# EAGLE schematic Main (EAGLE 8.7.0)
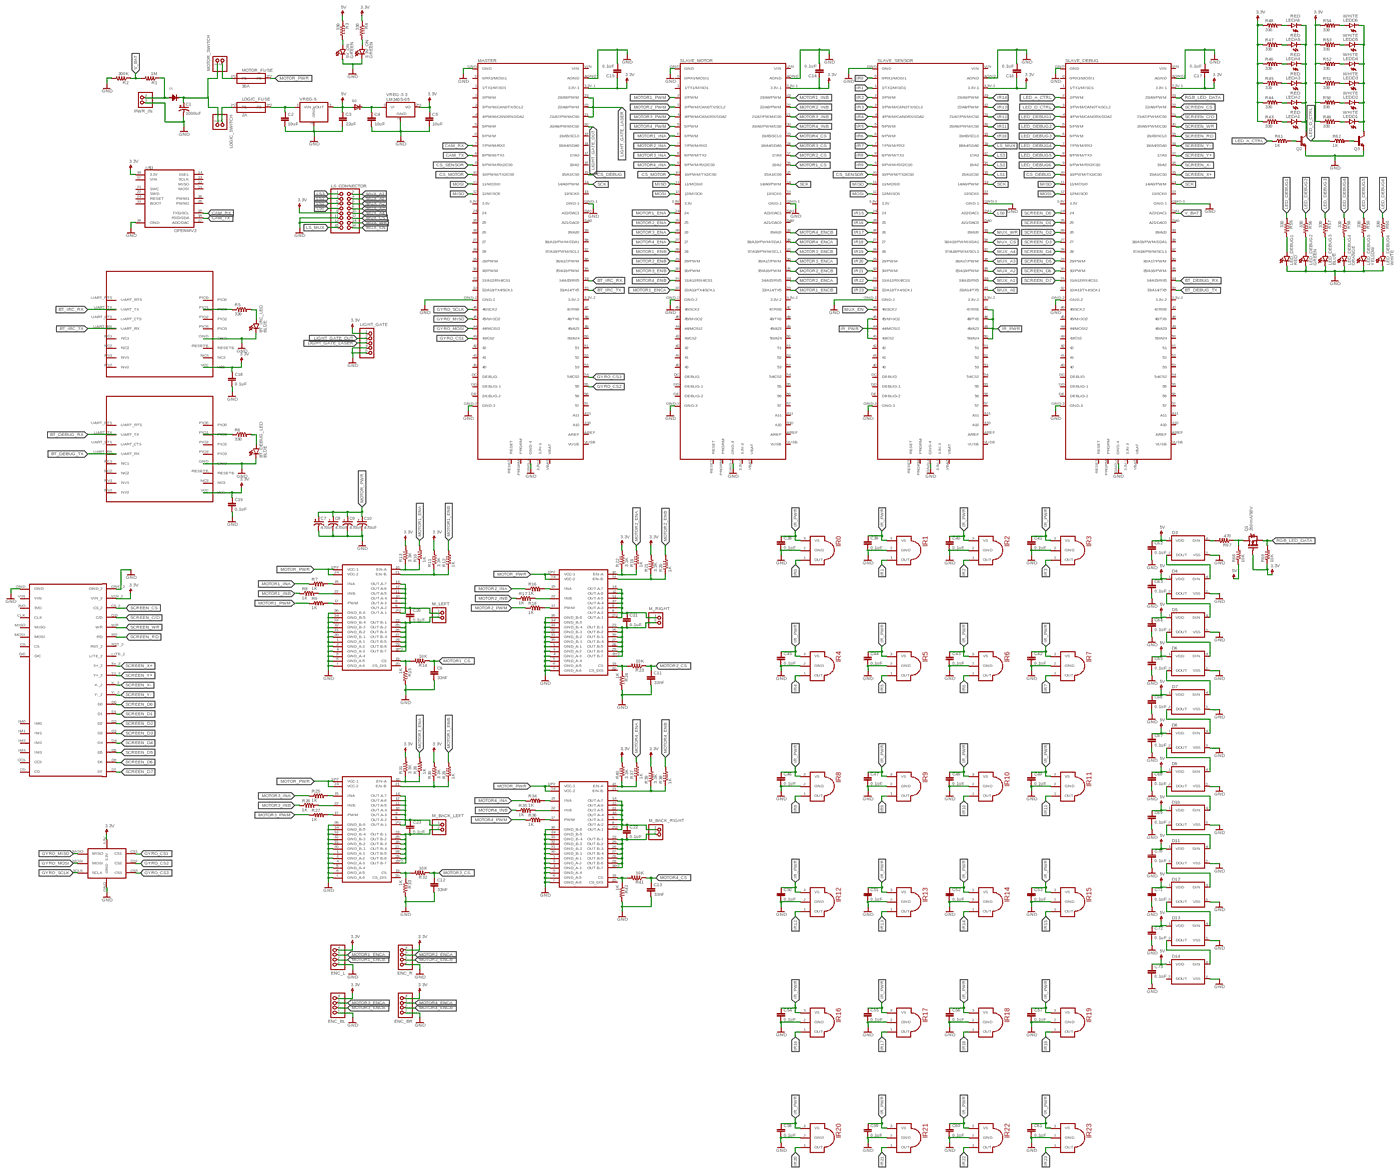
[diagram p0: schematic, sheet 1, overview]
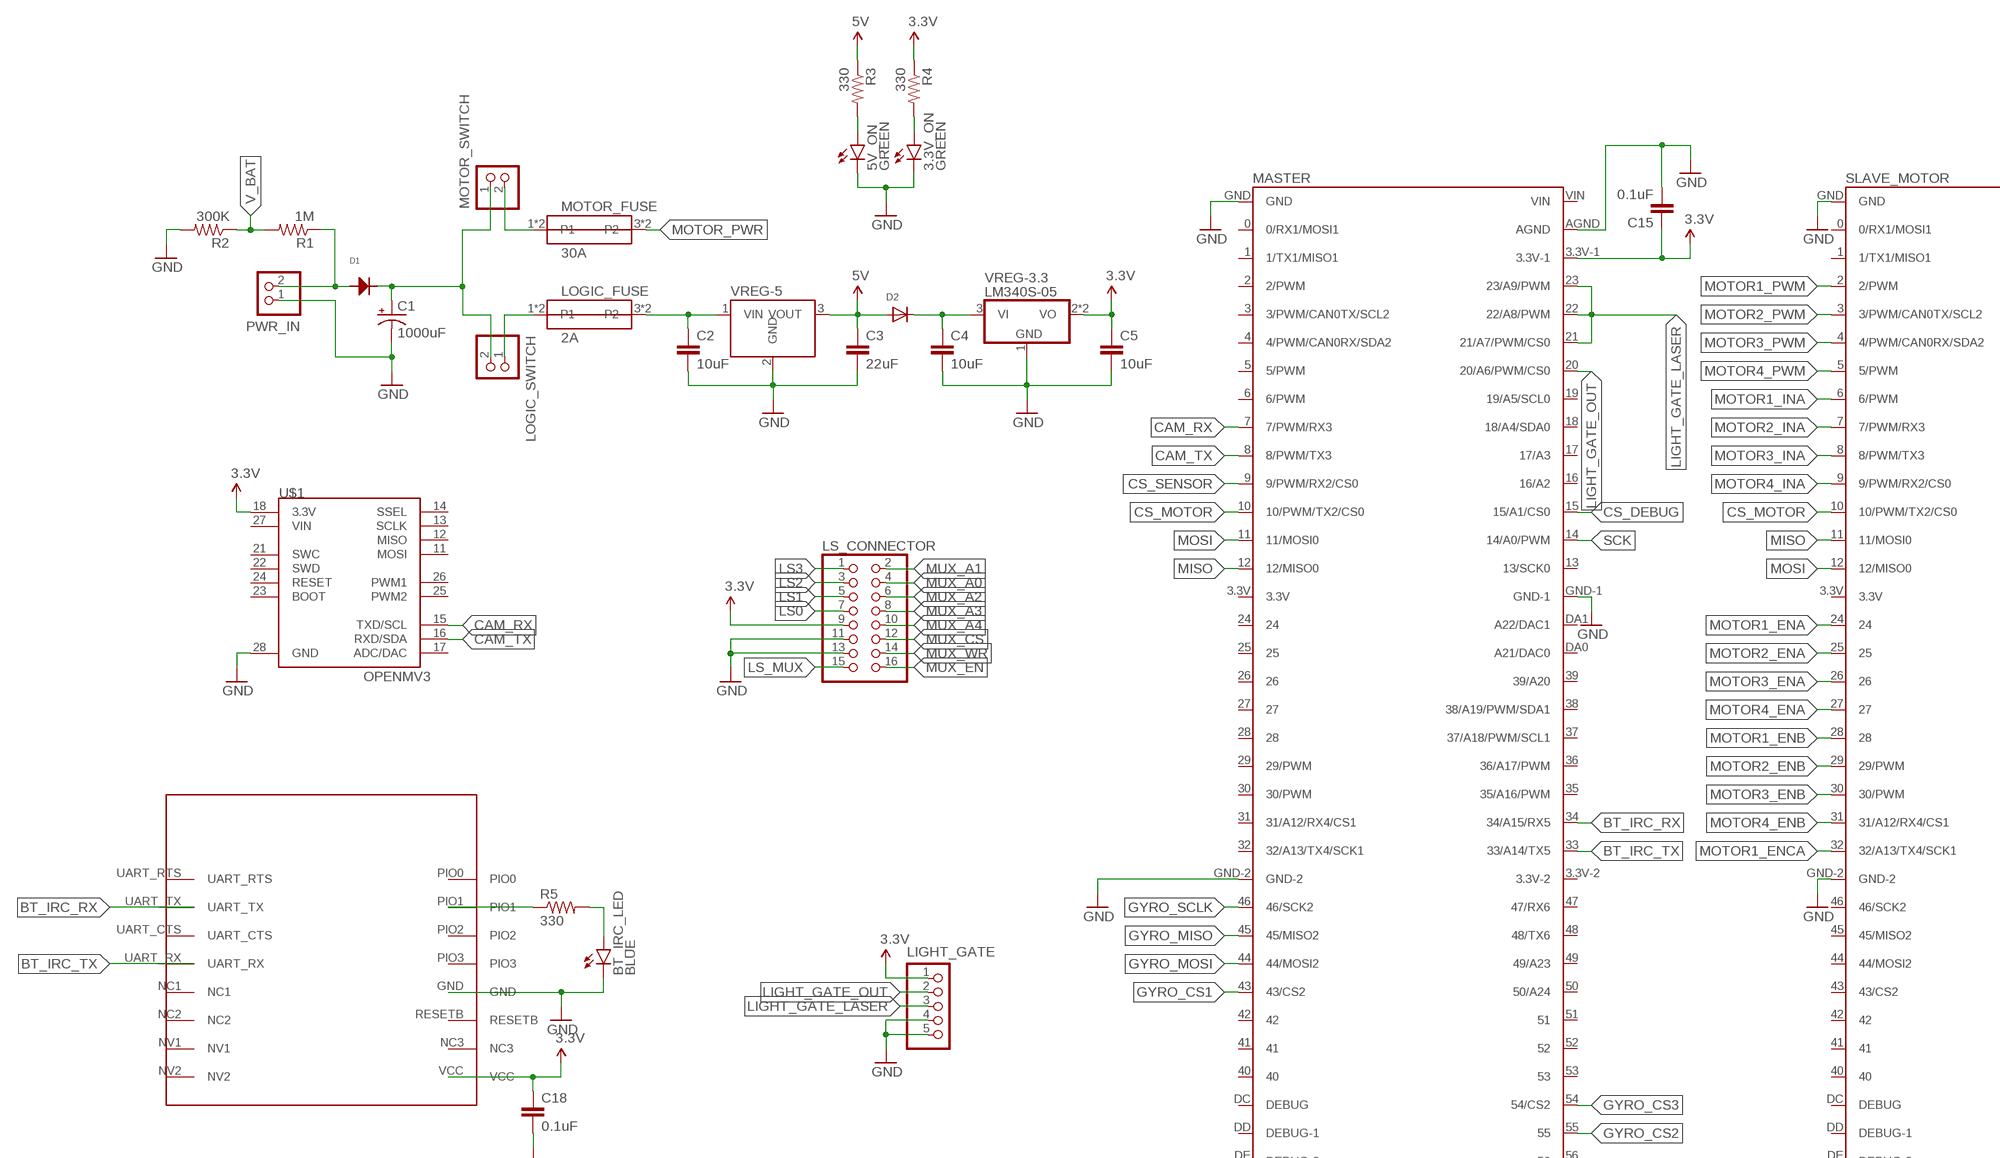
[diagram p1: schematic, sheet 1, part 1 of 4]
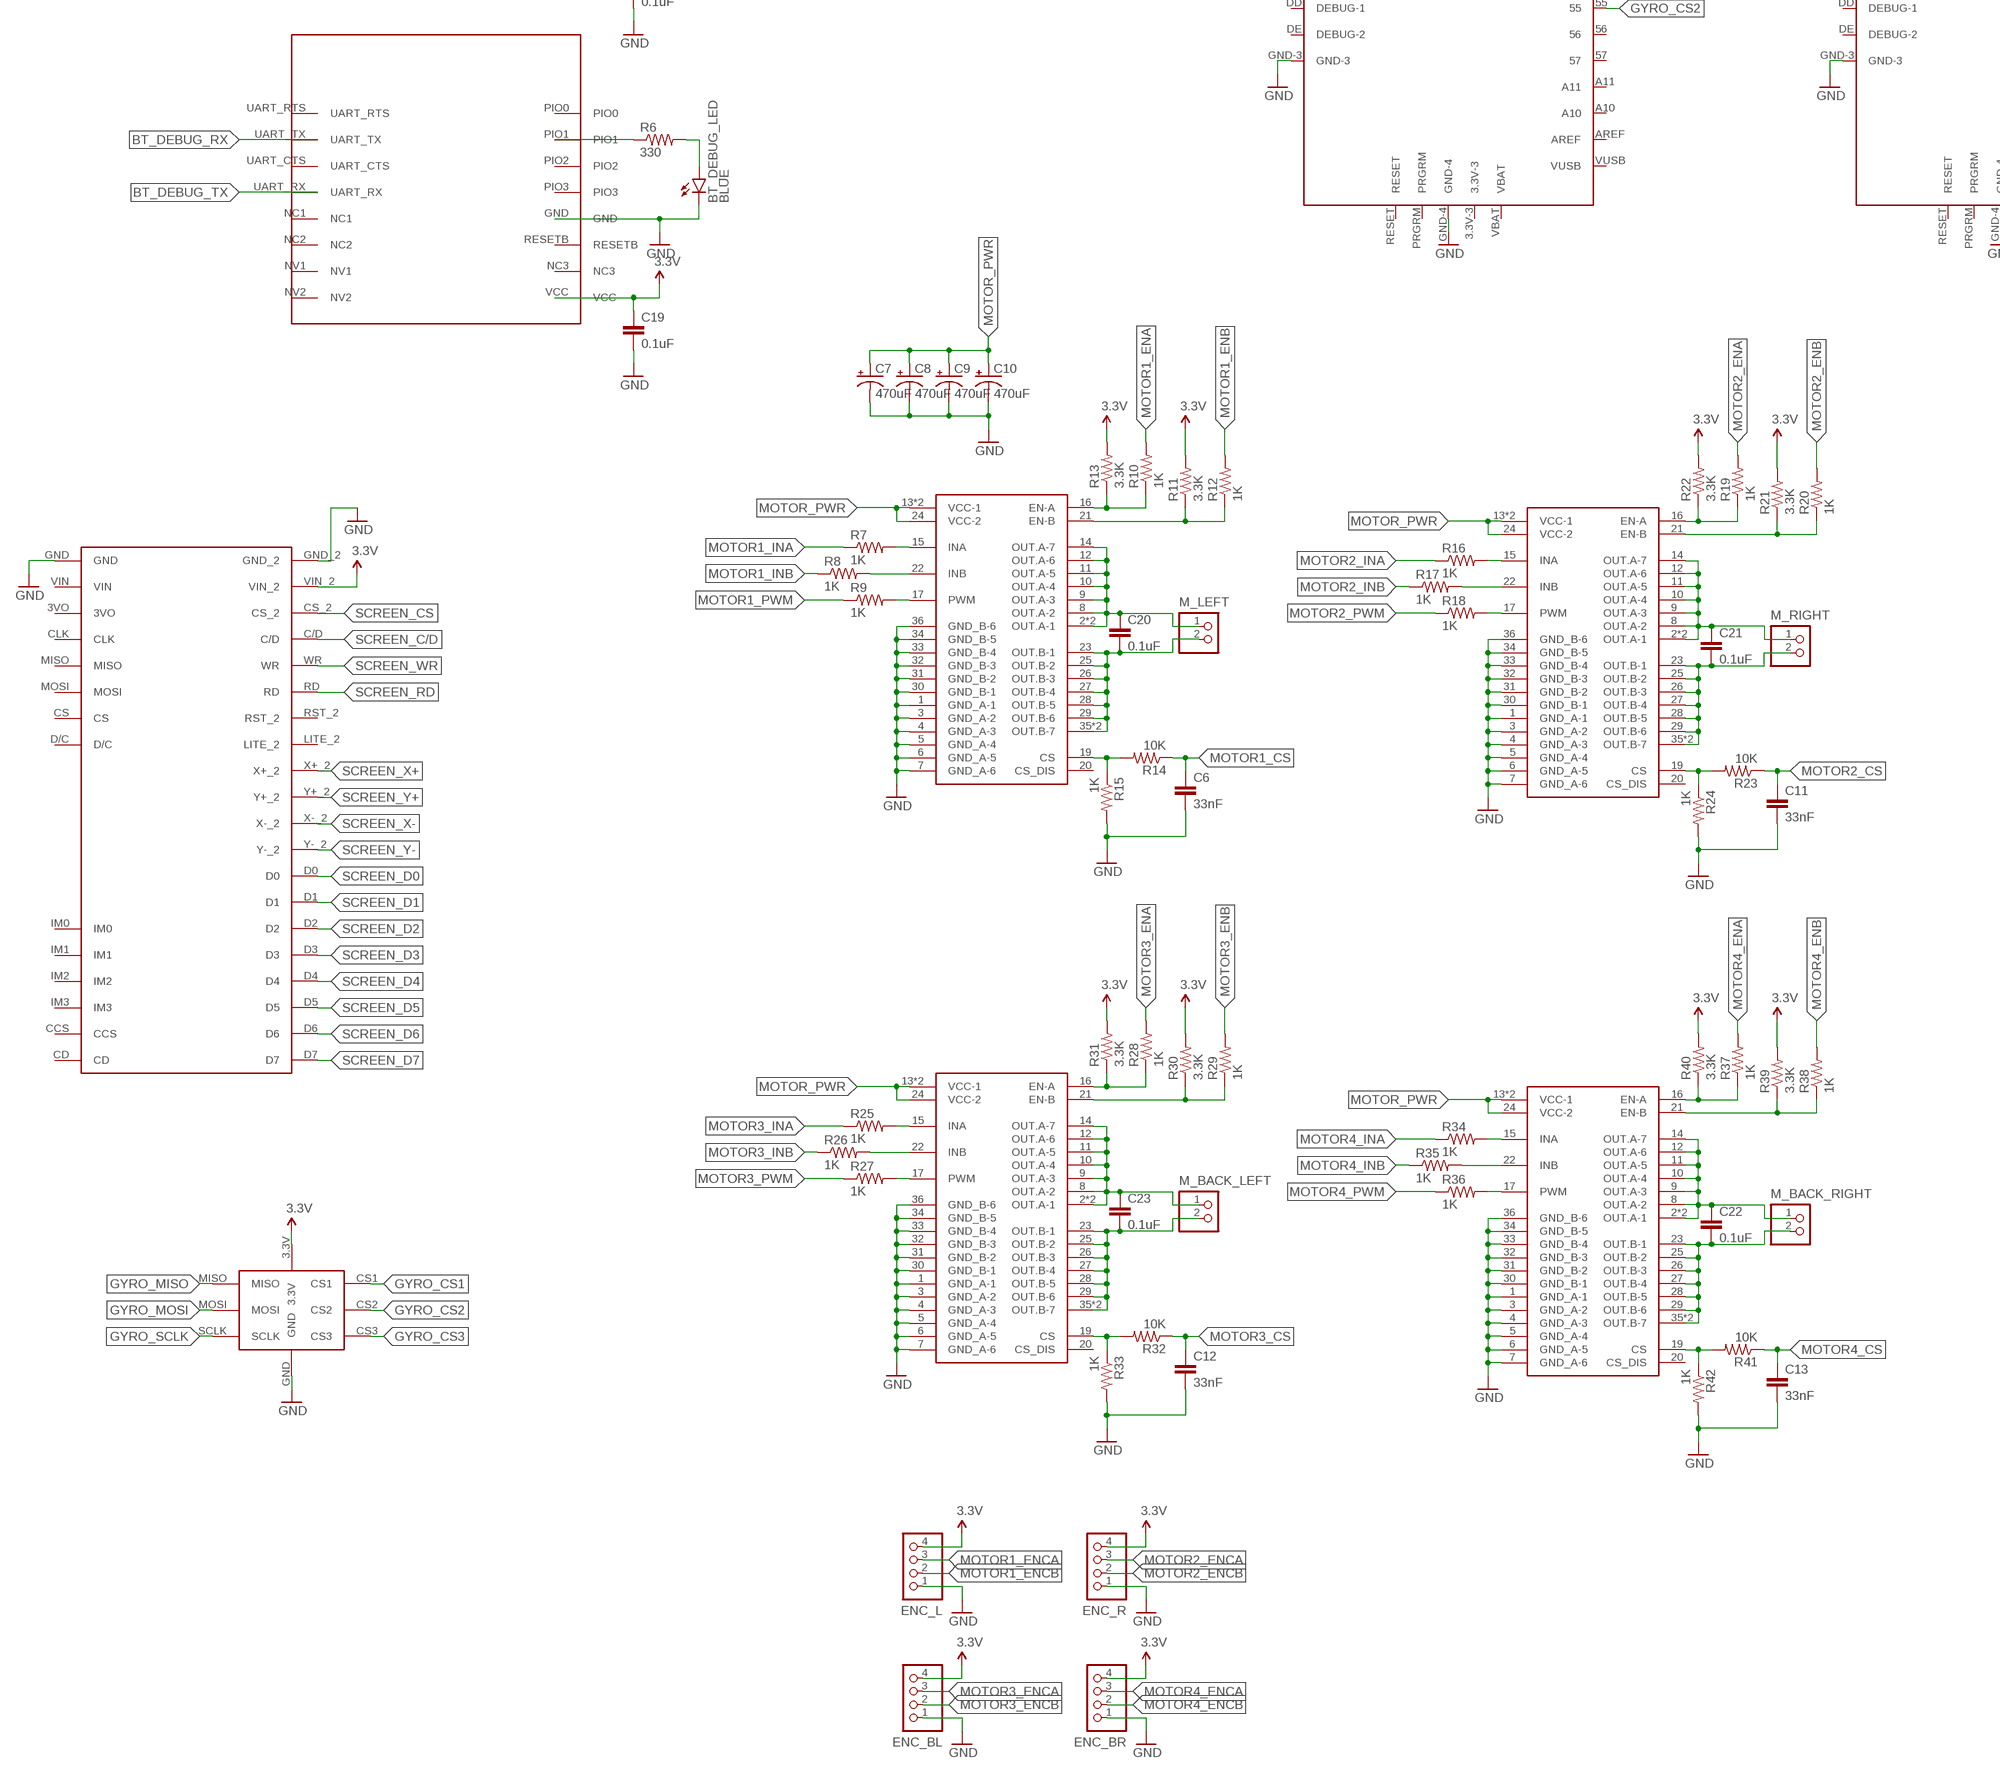
[diagram p2: schematic, sheet 1, part 2 of 4]
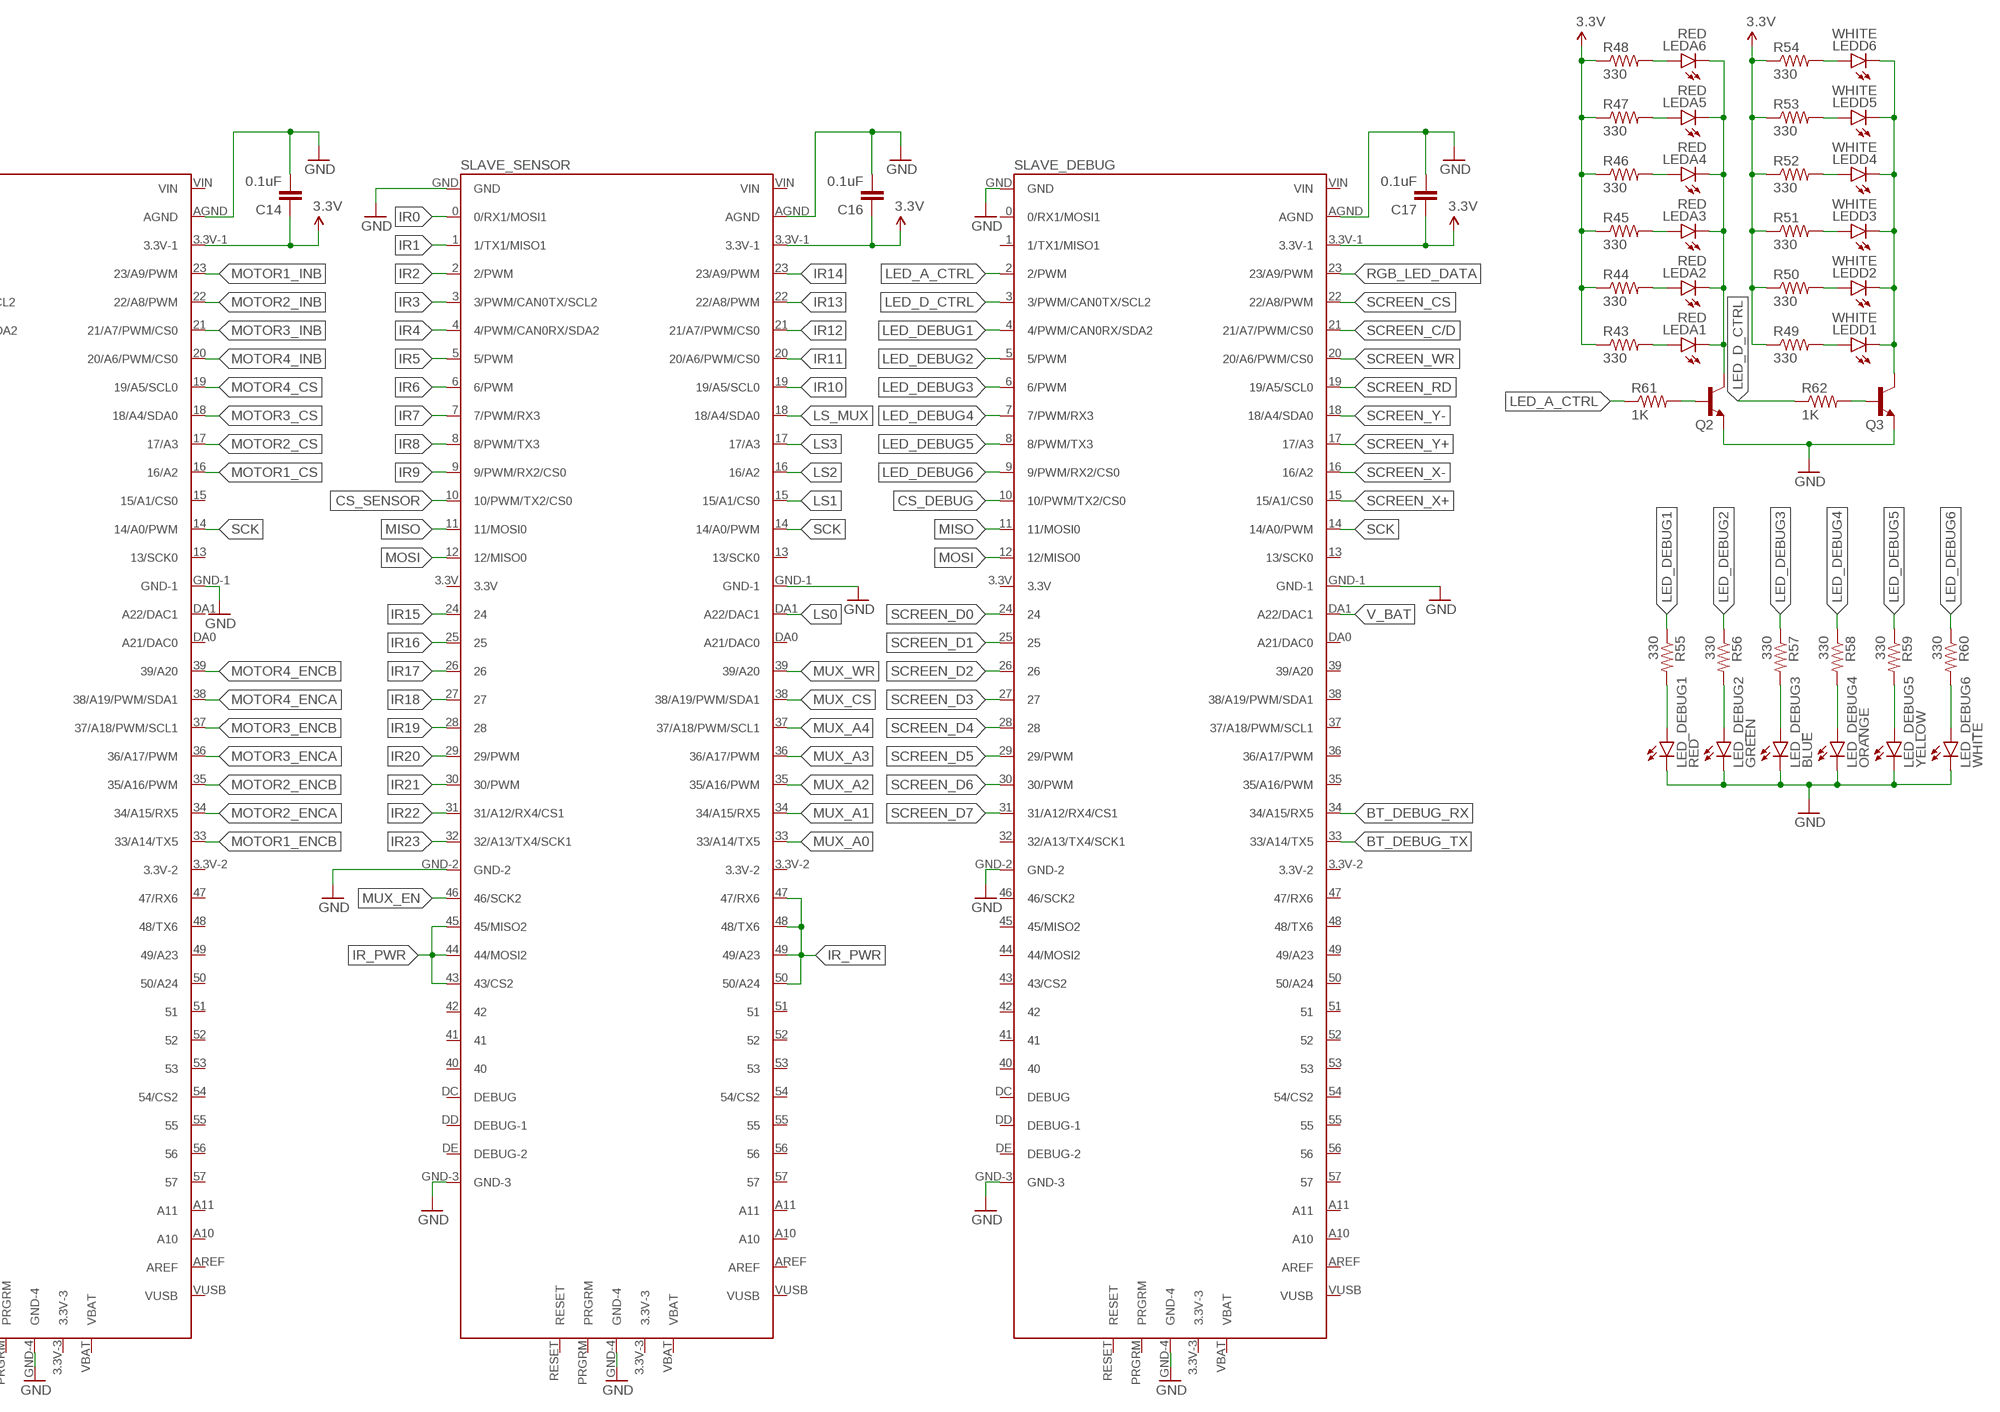
[diagram p3: schematic, sheet 1, part 3 of 4]
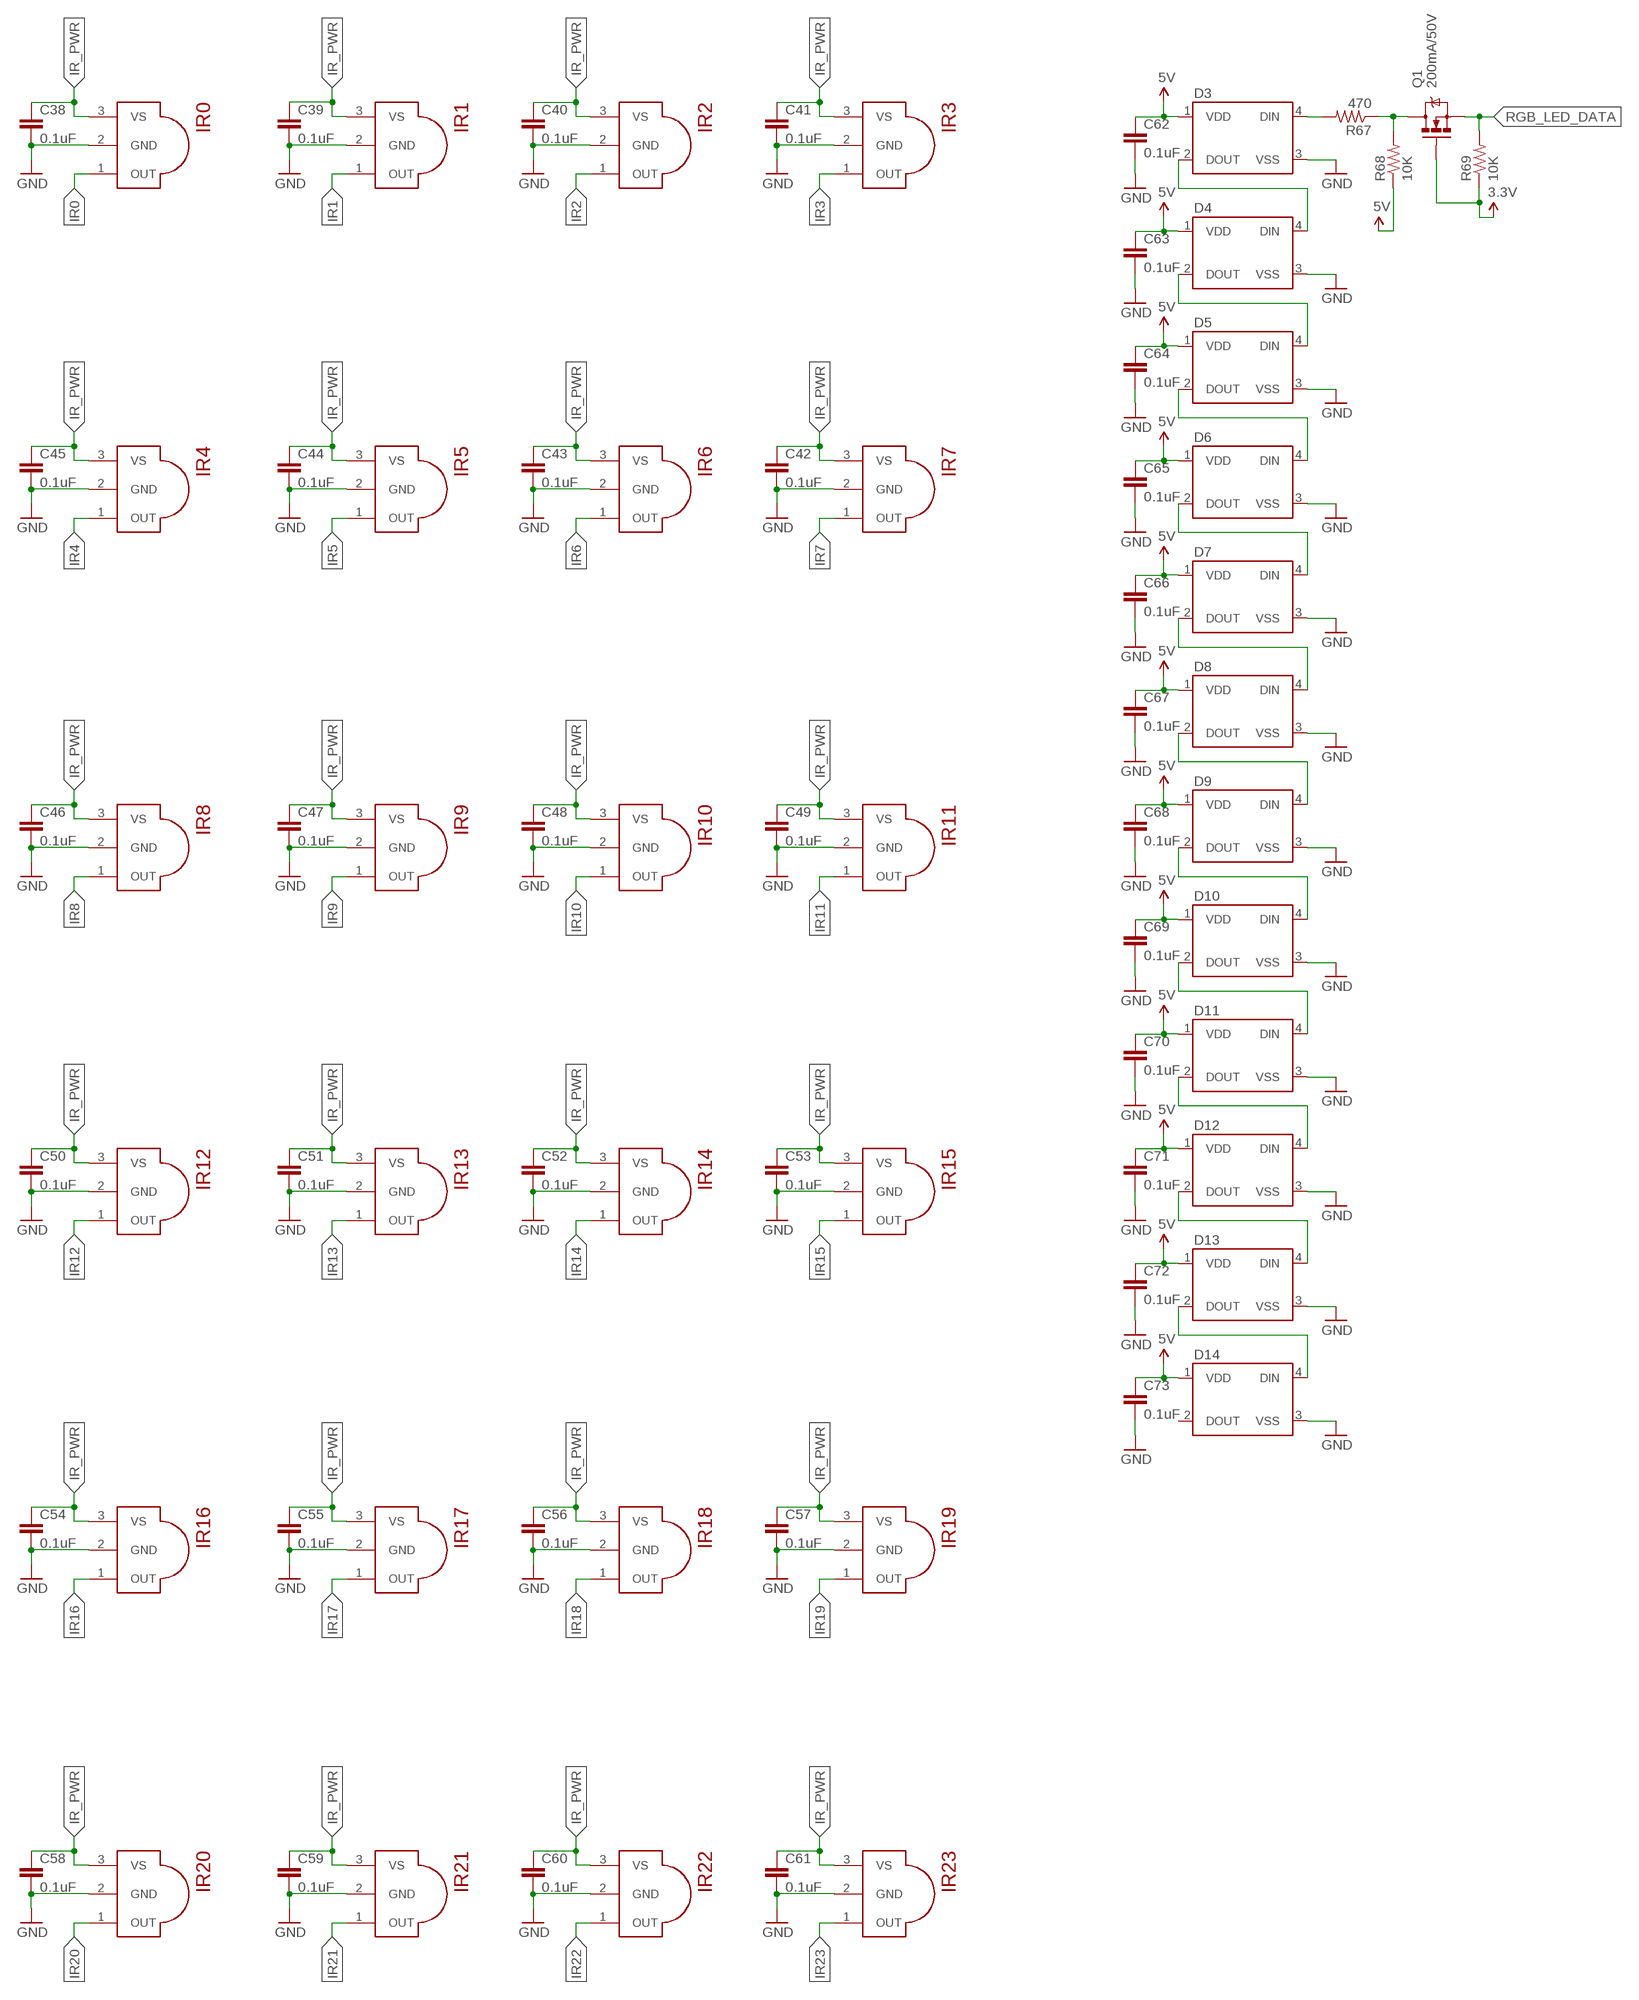
[diagram p4: schematic, sheet 1, part 4 of 4]

## Parts
3.3V_ON  GREEN  LED0603  [LED-0603]
5V_ON  GREEN  LED0603  [LED-0603]
BT_DEBUG  HM-11  [HM-11]
BT_DEBUG_LED  BLUE  LED0603  [LED-0603]
BT_IRC  HM-11  [HM-11]
BT_IRC_LED  BLUE  LED0603  [LED-0603]
C1  1000uF  1000UF-25V(PTH)  [CPOL-RADIAL-1000UF-25V]
C2  10uF  CAP0805  [0805]
C3  22uF  CAP1206  [1206]
C4  10uF  CAP0805  [0805]
C5  10uF  CAP0805  [0805]
C6  33nF  CAP0603-CAP  [0603-CAP]
C7  470uF  CPOL-USE3.5-8  [E3,5-8]
C8  470uF  CPOL-USE3.5-8  [E3,5-8]
C9  470uF  CPOL-USE3.5-8  [E3,5-8]
C10  470uF  CPOL-USE3.5-8  [E3,5-8]
C11  33nF  CAP0603-CAP  [0603-CAP]
C12  33nF  CAP0603-CAP  [0603-CAP]
C13  33nF  CAP0603-CAP  [0603-CAP]
C14  0.1uF  CAP0603-CAP  [0603-CAP]
C15  0.1uF  CAP0603-CAP  [0603-CAP]
C16  0.1uF  CAP0603-CAP  [0603-CAP]
C17  0.1uF  CAP0603-CAP  [0603-CAP]
C18  0.1uF  CAP0603-CAP  [0603-CAP]
C19  0.1uF  CAP0603-CAP  [0603-CAP]
C20  0.1uF  CAP0603-CAP  [0603-CAP]
C21  0.1uF  CAP0603-CAP  [0603-CAP]
C22  0.1uF  CAP0603-CAP  [0603-CAP]
C23  0.1uF  CAP0603-CAP  [0603-CAP]
C38  0.1uF  CAP0603-CAP  [0603-CAP]
C39  0.1uF  CAP0603-CAP  [0603-CAP]
C40  0.1uF  CAP0603-CAP  [0603-CAP]
C41  0.1uF  CAP0603-CAP  [0603-CAP]
C42  0.1uF  CAP0603-CAP  [0603-CAP]
C43  0.1uF  CAP0603-CAP  [0603-CAP]
C44  0.1uF  CAP0603-CAP  [0603-CAP]
C45  0.1uF  CAP0603-CAP  [0603-CAP]
C46  0.1uF  CAP0603-CAP  [0603-CAP]
C47  0.1uF  CAP0603-CAP  [0603-CAP]
C48  0.1uF  CAP0603-CAP  [0603-CAP]
C49  0.1uF  CAP0603-CAP  [0603-CAP]
C50  0.1uF  CAP0603-CAP  [0603-CAP]
C51  0.1uF  CAP0603-CAP  [0603-CAP]
C52  0.1uF  CAP0603-CAP  [0603-CAP]
C53  0.1uF  CAP0603-CAP  [0603-CAP]
C54  0.1uF  CAP0603-CAP  [0603-CAP]
C55  0.1uF  CAP0603-CAP  [0603-CAP]
C56  0.1uF  CAP0603-CAP  [0603-CAP]
C57  0.1uF  CAP0603-CAP  [0603-CAP]
C58  0.1uF  CAP0603-CAP  [0603-CAP]
C59  0.1uF  CAP0603-CAP  [0603-CAP]
C60  0.1uF  CAP0603-CAP  [0603-CAP]
C61  0.1uF  CAP0603-CAP  [0603-CAP]
C62  0.1uF  CAP0603-CAP  [0603-CAP]
C63  0.1uF  CAP0603-CAP  [0603-CAP]
C64  0.1uF  CAP0603-CAP  [0603-CAP]
C65  0.1uF  CAP0603-CAP  [0603-CAP]
C66  0.1uF  CAP0603-CAP  [0603-CAP]
C67  0.1uF  CAP0603-CAP  [0603-CAP]
C68  0.1uF  CAP0603-CAP  [0603-CAP]
C69  0.1uF  CAP0603-CAP  [0603-CAP]
C70  0.1uF  CAP0603-CAP  [0603-CAP]
C71  0.1uF  CAP0603-CAP  [0603-CAP]
C72  0.1uF  CAP0603-CAP  [0603-CAP]
C73  0.1uF  CAP0603-CAP  [0603-CAP]
D1  DIODE_D2PAK(TO-263AB)  [D2PAK(TO-263AB)]
D2  DIODE_SOD-123FL  [SOD-123FL]
D3  WS2812B  [WS2812B]
D4  WS2812B  [WS2812B]
D5  WS2812B  [WS2812B]
D6  WS2812B  [WS2812B]
D7  WS2812B  [WS2812B]
D8  WS2812B  [WS2812B]
D9  WS2812B  [WS2812B]
D10  WS2812B  [WS2812B]
D11  WS2812B  [WS2812B]
D12  WS2812B  [WS2812B]
D13  WS2812B  [WS2812B]
D14  WS2812B  [WS2812B]
ENC_BL  B4B-PH-K-S  [B4B-PH-K-S]
ENC_BR  B4B-PH-K-S  [B4B-PH-K-S]
ENC_L  B4B-PH-K-S  [B4B-PH-K-S]
ENC_R  B4B-PH-K-S  [B4B-PH-K-S]
IR0  TSSP58038  [TSSP58038]
IR1  TSSP58038  [TSSP58038]
IR2  TSSP58038  [TSSP58038]
IR3  TSSP58038  [TSSP58038]
IR4  TSSP58038  [TSSP58038]
IR5  TSSP58038  [TSSP58038]
IR6  TSSP58038  [TSSP58038]
IR7  TSSP58038  [TSSP58038]
IR8  TSSP58038  [TSSP58038]
IR9  TSSP58038  [TSSP58038]
IR10  TSSP58038  [TSSP58038]
IR11  TSSP58038  [TSSP58038]
IR12  TSSP58038  [TSSP58038]
IR13  TSSP58038  [TSSP58038]
IR14  TSSP58038  [TSSP58038]
IR15  TSSP58038  [TSSP58038]
IR16  TSSP58038  [TSSP58038]
IR17  TSSP58038  [TSSP58038]
IR18  TSSP58038  [TSSP58038]
IR19  TSSP58038  [TSSP58038]
IR20  TSSP58038  [TSSP58038]
IR21  TSSP58038  [TSSP58038]
IR22  TSSP58038  [TSSP58038]
IR23  TSSP58038  [TSSP58038]
LED_DEBUG1  RED  LED0603  [LED-0603]
LED_DEBUG2  GREEN  LED0603  [LED-0603]
LED_DEBUG3  BLUE  LED0603  [LED-0603]
LED_DEBUG4  ORANGE  LED0603  [LED-0603]
LED_DEBUG5  YELLOW  LED0603  [LED-0603]
LED_DEBUG6  WHITE  LED0603  [LED-0603]
LEDA1  RED  LED0603  [LED-0603]
LEDA2  RED  LED0603  [LED-0603]
LEDA3  RED  LED0603  [LED-0603]
LEDA4  RED  LED0603  [LED-0603]
LEDA5  RED  LED0603  [LED-0603]
LEDA6  RED  LED0603  [LED-0603]
LEDD1  WHITE  LED0603  [LED-0603]
LEDD2  WHITE  LED0603  [LED-0603]
LEDD3  WHITE  LED0603  [LED-0603]
LEDD4  WHITE  LED0603  [LED-0603]
LEDD5  WHITE  LED0603  [LED-0603]
LEDD6  WHITE  LED0603  [LED-0603]
LIGHT_GATE  B5B-PH-K-S  [B5B-PH-K-S]
LOGIC_FUSE  2A  3568-FUSEHOLDER  [3568-FUSEHOLDER]
LOGIC_SWITCH  B2P-VH  [B2P-VH]
LS_CONNECTOR  PINHD-2X8SMT  [2X08_SMT]
M_BACK_LEFT  B2P-VH  [B2P-VH]
M_BACK_RIGHT  B2P-VH  [B2P-VH]
M_LEFT  B2P-VH  [B2P-VH]
M_RIGHT  B2P-VH  [B2P-VH]
MASTER  TEENSY-3.5  [TEENSY-3.5]
MOTOR_FUSE  30A  3568-FUSEHOLDER  [3568-FUSEHOLDER]
MOTOR_SWITCH  B2P-VH  [B2P-VH]
P1  SOP50P1030X247-36N  [SOP50P1030X247-36N]
P2  SOP50P1030X247-36N  [SOP50P1030X247-36N]
P3  SOP50P1030X247-36N  [SOP50P1030X247-36N]
P4  SOP50P1030X247-36N  [SOP50P1030X247-36N]
PWR_IN  B2P-VH  [B2P-VH]
Q1  200mA/50V  MOSFET-NCHANNELBSS138  [SOT23-3]
Q2  TRANSISTOR_NPNSOT23-3  [SOT23-3]
Q3  TRANSISTOR_NPNSOT23-3  [SOT23-3]
R1  1M  RESISTOR0603-RES  [0603-RES]
R2  300K  RESISTOR0603-RES  [0603-RES]
R3  330  RESISTOR0603-RES  [0603-RES]
R4  330  RESISTOR0603-RES  [0603-RES]
R5  330  RESISTOR0603-RES  [0603-RES]
R6  330  RESISTOR0603-RES  [0603-RES]
R7  1K  RESISTOR0603-RES  [0603-RES]
R8  1K  RESISTOR0603-RES  [0603-RES]
R9  1K  RESISTOR0603-RES  [0603-RES]
R10  1K  RESISTOR0603-RES  [0603-RES]
R11  3.3K  RESISTOR0603-RES  [0603-RES]
R12  1K  RESISTOR0603-RES  [0603-RES]
R13  3.3K  RESISTOR0603-RES  [0603-RES]
R14  10K  RESISTOR0603-RES  [0603-RES]
R15  1K  RESISTOR0603-RES  [0603-RES]
R16  1K  RESISTOR0603-RES  [0603-RES]
R17  1K  RESISTOR0603-RES  [0603-RES]
R18  1K  RESISTOR0603-RES  [0603-RES]
R19  1K  RESISTOR0603-RES  [0603-RES]
R20  1K  RESISTOR0603-RES  [0603-RES]
R21  3.3K  RESISTOR0603-RES  [0603-RES]
R22  3.3K  RESISTOR0603-RES  [0603-RES]
R23  10K  RESISTOR0603-RES  [0603-RES]
R24  1K  RESISTOR0603-RES  [0603-RES]
R25  1K  RESISTOR0603-RES  [0603-RES]
R26  1K  RESISTOR0603-RES  [0603-RES]
R27  1K  RESISTOR0603-RES  [0603-RES]
R28  1K  RESISTOR0603-RES  [0603-RES]
R29  1K  RESISTOR0603-RES  [0603-RES]
R30  3.3K  RESISTOR0603-RES  [0603-RES]
R31  3.3K  RESISTOR0603-RES  [0603-RES]
R32  10K  RESISTOR0603-RES  [0603-RES]
R33  1K  RESISTOR0603-RES  [0603-RES]
R34  1K  RESISTOR0603-RES  [0603-RES]
R35  1K  RESISTOR0603-RES  [0603-RES]
R36  1K  RESISTOR0603-RES  [0603-RES]
R37  1K  RESISTOR0603-RES  [0603-RES]
R38  1K  RESISTOR0603-RES  [0603-RES]
R39  3.3K  RESISTOR0603-RES  [0603-RES]
R40  3.3K  RESISTOR0603-RES  [0603-RES]
R41  10K  RESISTOR0603-RES  [0603-RES]
R42  1K  RESISTOR0603-RES  [0603-RES]
R43  330  RESISTOR0603-RES  [0603-RES]
R44  330  RESISTOR0603-RES  [0603-RES]
R45  330  RESISTOR0603-RES  [0603-RES]
R46  330  RESISTOR0603-RES  [0603-RES]
R47  330  RESISTOR0603-RES  [0603-RES]
R48  330  RESISTOR0603-RES  [0603-RES]
R49  330  RESISTOR0603-RES  [0603-RES]
R50  330  RESISTOR0603-RES  [0603-RES]
R51  330  RESISTOR0603-RES  [0603-RES]
R52  330  RESISTOR0603-RES  [0603-RES]
R53  330  RESISTOR0603-RES  [0603-RES]
R54  330  RESISTOR0603-RES  [0603-RES]
R55  330  RESISTOR0603-RES  [0603-RES]
R56  330  RESISTOR0603-RES  [0603-RES]
R57  330  RESISTOR0603-RES  [0603-RES]
R58  330  RESISTOR0603-RES  [0603-RES]
R59  330  RESISTOR0603-RES  [0603-RES]
R60  330  RESISTOR0603-RES  [0603-RES]
R61  1K  RESISTOR0603-RES  [0603-RES]
R62  1K  RESISTOR0603-RES  [0603-RES]
R67  470  RESISTOR0603-RES  [0603-RES]
R68  10K  RESISTOR0603-RES  [0603-RES]
R69  10K  RESISTOR0603-RES  [0603-RES]
SCREEN  ADAFRUIT-2.4-TFT  [ADAFRUIT-2.4-TFT]
SLAVE_DEBUG  TEENSY-3.5  [TEENSY-3.5]
SLAVE_MOTOR  TEENSY-3.5  [TEENSY-3.5]
SLAVE_SENSOR  TEENSY-3.5  [TEENSY-3.5]
U$1  OPENMV3  [OPENMV3]
U$2  GYRO  [GYRO]
VREG-3.3  LM340S-05  [TO263-3]
VREG-5  V78-2000  [V78-2000]

## Nets
3.3V: BT_DEBUG.VCC BT_IRC.VCC C5.1 C14.1 C15.1 C16.1 C17.1 C18.1 C19.1 ENC_BL.4 ENC_BR.4 ENC_L.4 ENC_R.4 LIGHT_GATE.1 LS_CONNECTOR.9 MASTER.3.3V-1 Q1.1(G) R4.1 R11.2 R13.2 R21.2 R22.2 R30.2 R31.2 R39.2 R40.2 R43.1 R44.1 R45.1 R46.1 R47.1 R48.1 R49.1 R50.1 R51.1 R52.1 R53.1 R54.1 R69.1 SCREEN.VIN_2 SLAVE_DEBUG.3.3V-1 SLAVE_MOTOR.3.3V-1 SLAVE_SENSOR.3.3V-1 U$1.18(3.3V) U$2.3.3V VREG-3.3.2(VO) VREG-3.3.TAB(VO)
5V: C3.1 C62.1 C63.1 C64.1 C65.1 C66.1 C67.1 C68.1 C69.1 C70.1 C71.1 C72.1 C73.1 D2.A D3.1(VDD) D4.1(VDD) D5.1(VDD) D6.1(VDD) D7.1(VDD) D8.1(VDD) D9.1(VDD) D10.1(VDD) D11.1(VDD) D12.1(VDD) D13.1(VDD) D14.1(VDD) R3.1 R68.1 VREG-5.3(VOUT)
BT_DEBUG_RX: BT_DEBUG.UART_TX SLAVE_DEBUG.34(34/A15/RX5)
BT_DEBUG_TX: BT_DEBUG.UART_RX SLAVE_DEBUG.33(33/A14/TX5)
BT_IRC_RX: BT_IRC.UART_TX MASTER.34(34/A15/RX5)
BT_IRC_TX: BT_IRC.UART_RX MASTER.33(33/A14/TX5)
CAM_RX: MASTER.7(7/PWM/RX3) U$1.15(TXD/SCL)
CAM_TX: MASTER.8(8/PWM/TX3) U$1.16(RXD/SDA)
CS_DEBUG: MASTER.15(15/A1/CS0) SLAVE_DEBUG.10(10/PWM/TX2/CS0)
CS_MOTOR: MASTER.10(10/PWM/TX2/CS0) SLAVE_MOTOR.10(10/PWM/TX2/CS0)
CS_SENSOR: MASTER.9(9/PWM/RX2/CS0) SLAVE_SENSOR.10(10/PWM/TX2/CS0)
GND: 3.3V_ON.C 5V_ON.C BT_DEBUG.GND BT_DEBUG_LED.C BT_IRC.GND BT_IRC_LED.C C1.- C2.2 C3.2 C4.2 C5.2 C6.2 C7.- C8.- C9.- C10.- C11.2 C12.2 C13.2 C14.2 C15.2 C16.2 C17.2 C18.2 C19.2 C38.2 C39.2 C40.2 C41.2 C42.2 C43.2 C44.2 C45.2 C46.2 C47.2 C48.2 C49.2 C50.2 C51.2 C52.2 C53.2 C54.2 C55.2 C56.2 C57.2 C58.2 C59.2 C60.2 C61.2 C62.2 C63.2 C64.2 C65.2 C66.2 C67.2 C68.2 C69.2 C70.2 C71.2 C72.2 C73.2 D3.3(VSS) D4.3(VSS) D5.3(VSS) D6.3(VSS) D7.3(VSS) D8.3(VSS) D9.3(VSS) D10.3(VSS) D11.3(VSS) D12.3(VSS) D13.3(VSS) D14.3(VSS) ENC_BL.1 ENC_BR.1 ENC_L.1 ENC_R.1 IR0.2(GND) IR1.2(GND) IR2.2(GND) IR3.2(GND) IR4.2(GND) IR5.2(GND) IR6.2(GND) IR7.2(GND) IR8.2(GND) IR9.2(GND) IR10.2(GND) IR11.2(GND) IR12.2(GND) IR13.2(GND) IR14.2(GND) IR15.2(GND) IR16.2(GND) IR17.2(GND) IR18.2(GND) IR19.2(GND) IR20.2(GND) IR21.2(GND) IR22.2(GND) IR23.2(GND) LED_DEBUG1.C LED_DEBUG2.C LED_DEBUG3.C LED_DEBUG4.C LED_DEBUG5.C LED_DEBUG6.C LIGHT_GATE.4 LIGHT_GATE.5 LS_CONNECTOR.11 LS_CONNECTOR.13 MASTER.AGND MASTER.GND MASTER.GND-1 MASTER.GND-2 MASTER.GND-3 MASTER.GND-4 P1.1(GND_A-1) P1.3(GND_A-2) P1.4(GND_A-3) P1.5(GND_A-4) P1.6(GND_A-5) P1.7(GND_A-6) P1.30(GND_B-1) P1.31(GND_B-2) P1.32(GND_B-3) P1.33(GND_B-4) P1.34(GND_B-5) P1.36(GND_B-6) P2.1(GND_A-1) P2.3(GND_A-2) P2.4(GND_A-3) P2.5(GND_A-4) P2.6(GND_A-5) P2.7(GND_A-6) P2.30(GND_B-1) P2.31(GND_B-2) P2.32(GND_B-3) P2.33(GND_B-4) P2.34(GND_B-5) P2.36(GND_B-6) P3.1(GND_A-1) P3.3(GND_A-2) P3.4(GND_A-3) P3.5(GND_A-4) P3.6(GND_A-5) P3.7(GND_A-6) P3.30(GND_B-1) P3.31(GND_B-2) P3.32(GND_B-3) P3.33(GND_B-4) P3.34(GND_B-5) P3.36(GND_B-6) P4.1(GND_A-1) P4.3(GND_A-2) P4.4(GND_A-3) P4.5(GND_A-4) P4.6(GND_A-5) P4.7(GND_A-6) P4.30(GND_B-1) P4.31(GND_B-2) P4.32(GND_B-3) P4.33(GND_B-4) P4.34(GND_B-5) P4.36(GND_B-6) PWR_IN.1 Q2.2(E) Q3.2(E) R2.2 R15.2 R24.2 R33.2 R42.2 SCREEN.GND SCREEN.GND_2 SLAVE_DEBUG.AGND SLAVE_DEBUG.GND SLAVE_DEBUG.GND-1 SLAVE_DEBUG.GND-2 SLAVE_DEBUG.GND-3 SLAVE_DEBUG.GND-4 SLAVE_MOTOR.AGND SLAVE_MOTOR.GND SLAVE_MOTOR.GND-1 SLAVE_MOTOR.GND-2 SLAVE_MOTOR.GND-3 SLAVE_MOTOR.GND-4 SLAVE_SENSOR.AGND SLAVE_SENSOR.GND SLAVE_SENSOR.GND-1 SLAVE_SENSOR.GND-2 SLAVE_SENSOR.GND-3 SLAVE_SENSOR.GND-4 U$1.28(GND) U$2.GND VREG-3.3.1(GND) VREG-5.2(GND)
GYRO_CS1: MASTER.43(43/CS2) U$2.CS1
GYRO_CS2: MASTER.55 U$2.CS2
GYRO_CS3: MASTER.54(54/CS2) U$2.CS3
GYRO_MISO: MASTER.45(45/MISO2) U$2.MISO
GYRO_MOSI: MASTER.44(44/MOSI2) U$2.MOSI
GYRO_SCLK: MASTER.46(46/SCK2) U$2.SCLK
IR0: IR0.1(OUT) SLAVE_SENSOR.0(0/RX1/MOSI1)
IR1: IR1.1(OUT) SLAVE_SENSOR.1(1/TX1/MISO1)
IR2: IR2.1(OUT) SLAVE_SENSOR.2(2/PWM)
IR3: IR3.1(OUT) SLAVE_SENSOR.3(3/PWM/CAN0TX/SCL2)
IR4: IR4.1(OUT) SLAVE_SENSOR.4(4/PWM/CAN0RX/SDA2)
IR5: IR5.1(OUT) SLAVE_SENSOR.5(5/PWM)
IR6: IR6.1(OUT) SLAVE_SENSOR.6(6/PWM)
IR7: IR7.1(OUT) SLAVE_SENSOR.7(7/PWM/RX3)
IR8: IR8.1(OUT) SLAVE_SENSOR.8(8/PWM/TX3)
IR9: IR9.1(OUT) SLAVE_SENSOR.9(9/PWM/RX2/CS0)
IR10: IR10.1(OUT) SLAVE_SENSOR.19(19/A5/SCL0)
IR11: IR11.1(OUT) SLAVE_SENSOR.20(20/A6/PWM/CS0)
IR12: IR12.1(OUT) SLAVE_SENSOR.21(21/A7/PWM/CS0)
IR13: IR13.1(OUT) SLAVE_SENSOR.22(22/A8/PWM)
IR14: IR14.1(OUT) SLAVE_SENSOR.23(23/A9/PWM)
IR15: IR15.1(OUT) SLAVE_SENSOR.24
IR16: IR16.1(OUT) SLAVE_SENSOR.25
IR17: IR17.1(OUT) SLAVE_SENSOR.26
IR18: IR18.1(OUT) SLAVE_SENSOR.27
IR19: IR19.1(OUT) SLAVE_SENSOR.28
IR20: IR20.1(OUT) SLAVE_SENSOR.29(29/PWM)
IR21: IR21.1(OUT) SLAVE_SENSOR.30(30/PWM)
IR22: IR22.1(OUT) SLAVE_SENSOR.31(31/A12/RX4/CS1)
IR23: IR23.1(OUT) SLAVE_SENSOR.32(32/A13/TX4/SCK1)
IR_PWR: C38.1 C39.1 C40.1 C41.1 C42.1 C43.1 C44.1 C45.1 C46.1 C47.1 C48.1 C49.1 C50.1 C51.1 C52.1 C53.1 C54.1 C55.1 C56.1 C57.1 C58.1 C59.1 C60.1 C61.1 IR0.3(VS) IR1.3(VS) IR2.3(VS) IR3.3(VS) IR4.3(VS) IR5.3(VS) IR6.3(VS) IR7.3(VS) IR8.3(VS) IR9.3(VS) IR10.3(VS) IR11.3(VS) IR12.3(VS) IR13.3(VS) IR14.3(VS) IR15.3(VS) IR16.3(VS) IR17.3(VS) IR18.3(VS) IR19.3(VS) IR20.3(VS) IR21.3(VS) IR22.3(VS) IR23.3(VS) SLAVE_SENSOR.43(43/CS2) SLAVE_SENSOR.44(44/MOSI2) SLAVE_SENSOR.45(45/MISO2) SLAVE_SENSOR.47(47/RX6) SLAVE_SENSOR.48(48/TX6) SLAVE_SENSOR.49(49/A23) SLAVE_SENSOR.50(50/A24)
LED_A_CTRL: R61.1 SLAVE_DEBUG.2(2/PWM)
LED_D_CTRL: R62.1 SLAVE_DEBUG.3(3/PWM/CAN0TX/SCL2)
LED_DEBUG1: R55.1 SLAVE_DEBUG.4(4/PWM/CAN0RX/SDA2)
LED_DEBUG2: R56.1 SLAVE_DEBUG.5(5/PWM)
LED_DEBUG3: R57.1 SLAVE_DEBUG.6(6/PWM)
LED_DEBUG4: R58.1 SLAVE_DEBUG.7(7/PWM/RX3)
LED_DEBUG5: R59.1 SLAVE_DEBUG.8(8/PWM/TX3)
LED_DEBUG6: R60.1 SLAVE_DEBUG.9(9/PWM/RX2/CS0)
LIGHT_GATE_LASER: LIGHT_GATE.3 MASTER.21(21/A7/PWM/CS0) MASTER.22(22/A8/PWM) MASTER.23(23/A9/PWM)
LIGHT_GATE_OUT: LIGHT_GATE.2 MASTER.20(20/A6/PWM/CS0)
LS0: LS_CONNECTOR.7 SLAVE_SENSOR.DA1(A22/DAC1)
LS1: LS_CONNECTOR.5 SLAVE_SENSOR.15(15/A1/CS0)
LS2: LS_CONNECTOR.3 SLAVE_SENSOR.16(16/A2)
LS3: LS_CONNECTOR.1 SLAVE_SENSOR.17(17/A3)
LS_MUX: LS_CONNECTOR.15 SLAVE_SENSOR.18(18/A4/SDA0)
MISO: MASTER.12(12/MISO0) SLAVE_DEBUG.11(11/MOSI0) SLAVE_MOTOR.11(11/MOSI0) SLAVE_SENSOR.11(11/MOSI0)
MOSI: MASTER.11(11/MOSI0) SLAVE_DEBUG.12(12/MISO0) SLAVE_MOTOR.12(12/MISO0) SLAVE_SENSOR.12(12/MISO0)
MOTOR1_CS: C6.1 R14.1 SLAVE_MOTOR.16(16/A2)
MOTOR1_ENA: R10.2 SLAVE_MOTOR.24
MOTOR1_ENB: R12.2 SLAVE_MOTOR.28
MOTOR1_ENCA: ENC_L.3 SLAVE_MOTOR.32(32/A13/TX4/SCK1)
MOTOR1_ENCB: ENC_L.2 SLAVE_MOTOR.33(33/A14/TX5)
MOTOR1_INA: R7.1 SLAVE_MOTOR.6(6/PWM)
MOTOR1_INB: R8.1 SLAVE_MOTOR.23(23/A9/PWM)
MOTOR1_OUTA: C20.1 M_LEFT.1 P1.2(OUT.A-1) P1.8(OUT.A-2) P1.9(OUT.A-3) P1.10(OUT.A-4) P1.11(OUT.A-5) P1.12(OUT.A-6) P1.14(OUT.A-7) P1.SLUG2(OUT.A-1)
MOTOR1_OUTB: C20.2 M_LEFT.2 P1.23(OUT.B-1) P1.25(OUT.B-2) P1.26(OUT.B-3) P1.27(OUT.B-4) P1.28(OUT.B-5) P1.29(OUT.B-6) P1.35(OUT.B-7) P1.SLUG3(OUT.B-7)
MOTOR1_PWM: R9.1 SLAVE_MOTOR.2(2/PWM)
MOTOR2_CS: C11.1 R23.1 SLAVE_MOTOR.17(17/A3)
MOTOR2_ENA: R19.2 SLAVE_MOTOR.25
MOTOR2_ENB: R20.2 SLAVE_MOTOR.29(29/PWM)
MOTOR2_ENCA: ENC_R.3 SLAVE_MOTOR.34(34/A15/RX5)
MOTOR2_ENCB: ENC_R.2 SLAVE_MOTOR.35(35/A16/PWM)
MOTOR2_INA: R16.1 SLAVE_MOTOR.7(7/PWM/RX3)
MOTOR2_INB: R17.1 SLAVE_MOTOR.22(22/A8/PWM)
MOTOR2_OUTA: C21.1 M_RIGHT.1 P2.2(OUT.A-1) P2.8(OUT.A-2) P2.9(OUT.A-3) P2.10(OUT.A-4) P2.11(OUT.A-5) P2.12(OUT.A-6) P2.14(OUT.A-7) P2.SLUG2(OUT.A-1)
MOTOR2_OUTB: C21.2 M_RIGHT.2 P2.23(OUT.B-1) P2.25(OUT.B-2) P2.26(OUT.B-3) P2.27(OUT.B-4) P2.28(OUT.B-5) P2.29(OUT.B-6) P2.35(OUT.B-7) P2.SLUG3(OUT.B-7)
MOTOR2_PWM: R18.1 SLAVE_MOTOR.3(3/PWM/CAN0TX/SCL2)
MOTOR3_CS: C12.1 R32.1 SLAVE_MOTOR.18(18/A4/SDA0)
MOTOR3_ENA: R28.2 SLAVE_MOTOR.26
MOTOR3_ENB: R29.2 SLAVE_MOTOR.30(30/PWM)
MOTOR3_ENCA: ENC_BL.3 SLAVE_MOTOR.36(36/A17/PWM)
MOTOR3_ENCB: ENC_BL.2 SLAVE_MOTOR.37(37/A18/PWM/SCL1)
MOTOR3_INA: R25.1 SLAVE_MOTOR.8(8/PWM/TX3)
MOTOR3_INB: R26.1 SLAVE_MOTOR.21(21/A7/PWM/CS0)
MOTOR3_OUTA: C23.1 M_BACK_LEFT.1 P3.2(OUT.A-1) P3.8(OUT.A-2) P3.9(OUT.A-3) P3.10(OUT.A-4) P3.11(OUT.A-5) P3.12(OUT.A-6) P3.14(OUT.A-7) P3.SLUG2(OUT.A-1)
MOTOR3_OUTB: C23.2 M_BACK_LEFT.2 P3.23(OUT.B-1) P3.25(OUT.B-2) P3.26(OUT.B-3) P3.27(OUT.B-4) P3.28(OUT.B-5) P3.29(OUT.B-6) P3.35(OUT.B-7) P3.SLUG3(OUT.B-7)
MOTOR3_PWM: R27.1 SLAVE_MOTOR.4(4/PWM/CAN0RX/SDA2)
MOTOR4_CS: C13.1 R41.1 SLAVE_MOTOR.19(19/A5/SCL0)
MOTOR4_ENA: R37.2 SLAVE_MOTOR.27
MOTOR4_ENB: R38.2 SLAVE_MOTOR.31(31/A12/RX4/CS1)
MOTOR4_ENCA: ENC_BR.3 SLAVE_MOTOR.38(38/A19/PWM/SDA1)
MOTOR4_ENCB: ENC_BR.2 SLAVE_MOTOR.39(39/A20)
MOTOR4_INA: R34.1 SLAVE_MOTOR.9(9/PWM/RX2/CS0)
MOTOR4_INB: R35.1 SLAVE_MOTOR.20(20/A6/PWM/CS0)
MOTOR4_OUTA: C22.1 M_BACK_RIGHT.1 P4.2(OUT.A-1) P4.8(OUT.A-2) P4.9(OUT.A-3) P4.10(OUT.A-4) P4.11(OUT.A-5) P4.12(OUT.A-6) P4.14(OUT.A-7) P4.SLUG2(OUT.A-1)
MOTOR4_OUTB: C22.2 M_BACK_RIGHT.2 P4.23(OUT.B-1) P4.25(OUT.B-2) P4.26(OUT.B-3) P4.27(OUT.B-4) P4.28(OUT.B-5) P4.29(OUT.B-6) P4.35(OUT.B-7) P4.SLUG3(OUT.B-7)
MOTOR4_PWM: R36.1 SLAVE_MOTOR.5(5/PWM)
MOTOR_PWR: C7.+ C8.+ C9.+ C10.+ MOTOR_FUSE.3(P2) MOTOR_FUSE.4(P2) P1.13(VCC-1) P1.24(VCC-2) P1.SLUG1(VCC-1) P2.13(VCC-1) P2.24(VCC-2) P2.SLUG1(VCC-1) P3.13(VCC-1) P3.24(VCC-2) P3.SLUG1(VCC-1) P4.13(VCC-1) P4.24(VCC-2) P4.SLUG1(VCC-1)
MUX_A0: LS_CONNECTOR.4 SLAVE_SENSOR.33(33/A14/TX5)
MUX_A1: LS_CONNECTOR.2 SLAVE_SENSOR.34(34/A15/RX5)
MUX_A2: LS_CONNECTOR.6 SLAVE_SENSOR.35(35/A16/PWM)
MUX_A3: LS_CONNECTOR.8 SLAVE_SENSOR.36(36/A17/PWM)
MUX_A4: LS_CONNECTOR.10 SLAVE_SENSOR.37(37/A18/PWM/SCL1)
MUX_CS: LS_CONNECTOR.12 SLAVE_SENSOR.38(38/A19/PWM/SDA1)
MUX_EN: LS_CONNECTOR.16 SLAVE_SENSOR.46(46/SCK2)
MUX_WR: LS_CONNECTOR.14 SLAVE_SENSOR.39(39/A20)
N$1: MOTOR_FUSE.1 MOTOR_FUSE.2(P1) MOTOR_SWITCH.2
N$2: LOGIC_FUSE.1 LOGIC_FUSE.2(P1) LOGIC_SWITCH.1
N$3: LEDA1.A R43.2
N$4: LEDA2.A R44.2
N$5: LEDA3.A R45.2
N$6: LEDA4.A R46.2
N$8: LEDA5.A R47.2
N$9: LEDA6.A R48.2
N$10: LEDA1.C LEDA2.C LEDA3.C LEDA4.C LEDA5.C LEDA6.C Q2.3(C)
N$11: D1.A(ANODE) D1.NOP(ANODE) PWR_IN.2 R1.1
N$12: C1.+ D1.C(CATHODE) LOGIC_SWITCH.2 MOTOR_SWITCH.1
N$13: C2.1 LOGIC_FUSE.3(P2) LOGIC_FUSE.4(P2) VREG-5.1(VIN)
N$14: C4.1 D2.C VREG-3.3.3(VI)
N$15: 5V_ON.A R3.2
N$16: 3.3V_ON.A R4.2
N$17: BT_IRC_LED.A R5.2
N$18: BT_IRC.PIO1 R5.1
N$19: BT_DEBUG_LED.A R6.2
N$20: BT_DEBUG.PIO1 R6.1
N$21: P1.16(EN-A) R10.1 R13.1
N$22: P1.22(INB) R8.2
N$23: P1.17(PWM) R9.2
N$24: P1.15(INA) R7.2
N$25: P1.21(EN-B) R11.1 R12.1
N$26: P1.19(CS) R14.2 R15.1
N$27: LEDD1.A R49.2
N$28: P2.15(INA) R16.2
N$29: P2.22(INB) R17.2
N$30: P2.17(PWM) R18.2
N$31: P2.16(EN-A) R19.1 R22.1
N$32: P2.21(EN-B) R20.1 R21.1
N$33: P2.19(CS) R23.2 R24.1
N$34: P3.15(INA) R25.2
N$35: P3.22(INB) R26.2
N$36: P3.17(PWM) R27.2
N$37: P3.16(EN-A) R28.1 R31.1
N$38: P3.21(EN-B) R29.1 R30.1
N$39: P3.19(CS) R32.2 R33.1
N$40: P4.15(INA) R34.2
N$41: P4.22(INB) R35.2
N$42: P4.17(PWM) R36.2
N$43: P4.16(EN-A) R37.1 R40.1
N$44: P4.21(EN-B) R38.1 R39.1
N$45: P4.19(CS) R41.2 R42.1
N$46: LEDD2.A R50.2
N$47: LEDD3.A R51.2
N$48: LEDD4.A R52.2
N$49: LEDD5.A R53.2
N$50: LEDD6.A R54.2
N$51: LEDD1.C LEDD2.C LEDD3.C LEDD4.C LEDD5.C LEDD6.C Q3.3(C)
N$52: LED_DEBUG1.A R55.2
N$53: LED_DEBUG2.A R56.2
N$54: LED_DEBUG3.A R57.2
N$55: LED_DEBUG4.A R58.2
N$56: LED_DEBUG5.A R59.2
N$57: LED_DEBUG6.A R60.2
N$58: Q2.1(B) R61.2
N$59: Q3.1(B) R62.2
N$69: D3.2(DOUT) D4.4(DIN)
N$70: D4.2(DOUT) D5.4(DIN)
N$71: D5.2(DOUT) D6.4(DIN)
N$72: D6.2(DOUT) D7.4(DIN)
N$73: D7.2(DOUT) D8.4(DIN)
N$74: D8.2(DOUT) D9.4(DIN)
N$75: D9.2(DOUT) D10.4(DIN)
N$76: D10.2(DOUT) D11.4(DIN)
N$77: D11.2(DOUT) D12.4(DIN)
N$78: D12.2(DOUT) D13.4(DIN)
N$79: D13.2(DOUT) D14.4(DIN)
N$80: Q1.3(D) R67.1 R68.2
N$94: D3.4(DIN) R67.2
RGB_LED_DATA: Q1.2(S) R69.2 SLAVE_DEBUG.23(23/A9/PWM)
SCK: MASTER.14(14/A0/PWM) SLAVE_DEBUG.14(14/A0/PWM) SLAVE_MOTOR.14(14/A0/PWM) SLAVE_SENSOR.14(14/A0/PWM)
SCREEN_C/D: SCREEN.C/D SLAVE_DEBUG.21(21/A7/PWM/CS0)
SCREEN_CS: SCREEN.CS_2 SLAVE_DEBUG.22(22/A8/PWM)
SCREEN_D0: SCREEN.D0 SLAVE_DEBUG.24
SCREEN_D1: SCREEN.D1 SLAVE_DEBUG.25
SCREEN_D2: SCREEN.D2 SLAVE_DEBUG.26
SCREEN_D3: SCREEN.D3 SLAVE_DEBUG.27
SCREEN_D4: SCREEN.D4 SLAVE_DEBUG.28
SCREEN_D5: SCREEN.D5 SLAVE_DEBUG.29(29/PWM)
SCREEN_D6: SCREEN.D6 SLAVE_DEBUG.30(30/PWM)
SCREEN_D7: SCREEN.D7 SLAVE_DEBUG.31(31/A12/RX4/CS1)
SCREEN_RD: SCREEN.RD SLAVE_DEBUG.19(19/A5/SCL0)
SCREEN_WR: SCREEN.WR SLAVE_DEBUG.20(20/A6/PWM/CS0)
SCREEN_X+: SCREEN.X+_2 SLAVE_DEBUG.15(15/A1/CS0)
SCREEN_X-: SCREEN.X-_2 SLAVE_DEBUG.16(16/A2)
SCREEN_Y+: SCREEN.Y+_2 SLAVE_DEBUG.17(17/A3)
SCREEN_Y-: SCREEN.Y-_2 SLAVE_DEBUG.18(18/A4/SDA0)
V_BAT: R1.2 R2.1 SLAVE_DEBUG.DA1(A22/DAC1)
Unconnected: BT_DEBUG.NC1 BT_DEBUG.NC2 BT_DEBUG.NC3 BT_DEBUG.NV1 BT_DEBUG.NV2 BT_DEBUG.PIO0 BT_DEBUG.PIO2 BT_DEBUG.PIO3 BT_DEBUG.RESETB BT_DEBUG.UART_CTS BT_DEBUG.UART_RTS BT_IRC.NC1 BT_IRC.NC2 BT_IRC.NC3 BT_IRC.NV1 BT_IRC.NV2 BT_IRC.PIO0 BT_IRC.PIO2 BT_IRC.PIO3 BT_IRC.RESETB BT_IRC.UART_CTS BT_IRC.UART_RTS D14.2(DOUT) MASTER.0(0/RX1/MOSI1) MASTER.1(1/TX1/MISO1) MASTER.2(2/PWM) MASTER.3(3/PWM/CAN0TX/SCL2) MASTER.3.3V MASTER.3.3V-2 MASTER.3.3V-3 MASTER.4(4/PWM/CAN0RX/SDA2) MASTER.5(5/PWM) MASTER.6(6/PWM) MASTER.13(13/SCK0) MASTER.16(16/A2) MASTER.17(17/A3) MASTER.18(18/A4/SDA0) MASTER.19(19/A5/SCL0) MASTER.24 MASTER.25 MASTER.26 MASTER.27 MASTER.28 MASTER.29(29/PWM) MASTER.30(30/PWM) MASTER.31(31/A12/RX4/CS1) MASTER.32(32/A13/TX4/SCK1) MASTER.35(35/A16/PWM) MASTER.36(36/A17/PWM) MASTER.37(37/A18/PWM/SCL1) MASTER.38(38/A19/PWM/SDA1) MASTER.39(39/A20) MASTER.40 MASTER.41 MASTER.42 MASTER.47(47/RX6) MASTER.48(48/TX6) MASTER.49(49/A23) MASTER.50(50/A24) MASTER.51 MASTER.52 MASTER.53 MASTER.56 MASTER.57 MASTER.A10 MASTER.A11 MASTER.AREF MASTER.DA0(A21/DAC0) MASTER.DA1(A22/DAC1) MASTER.DC(DEBUG) MASTER.DD(DEBUG-1) MASTER.DE(DEBUG-2) MASTER.PRGRM MASTER.RESET MASTER.VBAT MASTER.VIN MASTER.VUSB P1.20(CS_DIS) P2.20(CS_DIS) P3.20(CS_DIS) P4.20(CS_DIS) SCREEN.3VO SCREEN.CCS SCREEN.CD SCREEN.CLK SCREEN.CS SCREEN.D/C SCREEN.IM0 SCREEN.IM1 SCREEN.IM2 SCREEN.IM3 SCREEN.LITE_2 SCREEN.MISO SCREEN.MOSI SCREEN.RST_2 SCREEN.VIN SLAVE_DEBUG.0(0/RX1/MOSI1) SLAVE_DEBUG.1(1/TX1/MISO1) SLAVE_DEBUG.3.3V SLAVE_DEBUG.3.3V-2 SLAVE_DEBUG.3.3V-3 SLAVE_DEBUG.13(13/SCK0) SLAVE_DEBUG.32(32/A13/TX4/SCK1) SLAVE_DEBUG.35(35/A16/PWM) SLAVE_DEBUG.36(36/A17/PWM) SLAVE_DEBUG.37(37/A18/PWM/SCL1) SLAVE_DEBUG.38(38/A19/PWM/SDA1) SLAVE_DEBUG.39(39/A20) SLAVE_DEBUG.40 SLAVE_DEBUG.41 SLAVE_DEBUG.42 SLAVE_DEBUG.43(43/CS2) SLAVE_DEBUG.44(44/MOSI2) SLAVE_DEBUG.45(45/MISO2) SLAVE_DEBUG.46(46/SCK2) SLAVE_DEBUG.47(47/RX6) SLAVE_DEBUG.48(48/TX6) SLAVE_DEBUG.49(49/A23) SLAVE_DEBUG.50(50/A24) SLAVE_DEBUG.51 SLAVE_DEBUG.52 SLAVE_DEBUG.53 SLAVE_DEBUG.54(54/CS2) SLAVE_DEBUG.55 SLAVE_DEBUG.56 SLAVE_DEBUG.57 SLAVE_DEBUG.A10 SLAVE_DEBUG.A11 SLAVE_DEBUG.AREF SLAVE_DEBUG.DA0(A21/DAC0) SLAVE_DEBUG.DC(DEBUG) SLAVE_DEBUG.DD(DEBUG-1) SLAVE_DEBUG.DE(DEBUG-2) SLAVE_DEBUG.PRGRM SLAVE_DEBUG.RESET SLAVE_DEBUG.VBAT SLAVE_DEBUG.VIN SLAVE_DEBUG.VUSB SLAVE_MOTOR.0(0/RX1/MOSI1) SLAVE_MOTOR.1(1/TX1/MISO1) SLAVE_MOTOR.3.3V SLAVE_MOTOR.3.3V-2 SLAVE_MOTOR.3.3V-3 SLAVE_MOTOR.13(13/SCK0) SLAVE_MOTOR.15(15/A1/CS0) SLAVE_MOTOR.40 SLAVE_MOTOR.41 SLAVE_MOTOR.42 SLAVE_MOTOR.43(43/CS2) SLAVE_MOTOR.44(44/MOSI2) SLAVE_MOTOR.45(45/MISO2) SLAVE_MOTOR.46(46/SCK2) SLAVE_MOTOR.47(47/RX6) SLAVE_MOTOR.48(48/TX6) SLAVE_MOTOR.49(49/A23) SLAVE_MOTOR.50(50/A24) SLAVE_MOTOR.51 SLAVE_MOTOR.52 SLAVE_MOTOR.53 SLAVE_MOTOR.54(54/CS2) SLAVE_MOTOR.55 SLAVE_MOTOR.56 SLAVE_MOTOR.57 SLAVE_MOTOR.A10 SLAVE_MOTOR.A11 SLAVE_MOTOR.AREF SLAVE_MOTOR.DA0(A21/DAC0) SLAVE_MOTOR.DA1(A22/DAC1) SLAVE_MOTOR.DC(DEBUG) SLAVE_MOTOR.DD(DEBUG-1) SLAVE_MOTOR.DE(DEBUG-2) SLAVE_MOTOR.PRGRM SLAVE_MOTOR.RESET SLAVE_MOTOR.VBAT SLAVE_MOTOR.VIN SLAVE_MOTOR.VUSB SLAVE_SENSOR.3.3V SLAVE_SENSOR.3.3V-2 SLAVE_SENSOR.3.3V-3 SLAVE_SENSOR.13(13/SCK0) SLAVE_SENSOR.40 SLAVE_SENSOR.41 SLAVE_SENSOR.42 SLAVE_SENSOR.51 SLAVE_SENSOR.52 SLAVE_SENSOR.53 SLAVE_SENSOR.54(54/CS2) SLAVE_SENSOR.55 SLAVE_SENSOR.56 SLAVE_SENSOR.57 SLAVE_SENSOR.A10 SLAVE_SENSOR.A11 SLAVE_SENSOR.AREF SLAVE_SENSOR.DA0(A21/DAC0) SLAVE_SENSOR.DC(DEBUG) SLAVE_SENSOR.DD(DEBUG-1) SLAVE_SENSOR.DE(DEBUG-2) SLAVE_SENSOR.PRGRM SLAVE_SENSOR.RESET SLAVE_SENSOR.VBAT SLAVE_SENSOR.VIN SLAVE_SENSOR.VUSB U$1.11(MOSI) U$1.12(MISO) U$1.13(SCLK) U$1.14(SSEL) U$1.17(ADC/DAC) U$1.21(SWC) U$1.22(SWD) U$1.23(BOOT) U$1.24(RESET) U$1.25(PWM2) U$1.26(PWM1)

## Power pins joined to a net without a drawn wire
VIN: U$1.27(VIN)

## Library data of the parts
3.3V_ON 5V_ON BT_DEBUG_LED BT_IRC_LED LED_DEBUG1-LED_DEBUG6 LEDA1-LEDA6 LEDD1-LEDD6 = SparkFun-LED:LED: LEDs Standard schematic elements and footprints for 5mm, 3mm, 1206, and 0603 sized LEDs. 5mm - Spark Fun Electronics SKU : COM-00529 (and others)
BT_DEBUG BT_IRC = HM-11:HM-11
C1 = SparkFun-Capacitors:1000UF-25V(PTH): CAP-08070; PROD_ID: CAP-09538; VALUE: CAP-09538
C2-C6 C11-C23 C38-C73 = SparkFun-Capacitors:CAP: Capacitor Standard 0603 ceramic capacitor, and 0.1" leaded capacitor.
C7-C10 = rcl:CPOL-US: POLARIZED CAPACITOR, American symbol
D1 = PP_Passives:DIODE: Diode - Single
D2 = adafruit:DIODE: Diode SMADIODE - SMA Surface Mount Package 20V 1A Schottky Diode Digikey: 641-1014-6-ND DO-1N4148 - Through Hole Small Current Diode SOD-123 20V 1 A (.5mV Vf) Schottky Diode - Digikey: MBRX120TPMSCT-ND SOD-323 10V 570mA (.38mV Vf, 3ns) Schottky Diode - Digikey: ZLLS410CT-ND SOD-523 30V 30mA Schottky Diode (RB751S-40TE61) - Digikey: RB751S-40TE61CT-ND SOT23-R/W - SOT23 Package (R = Solder Paste/Reflow Ovens, W = Hand-Soldering) BAT54Film 40V 300mA - Digikey: 497-7162-1-ND
D3-D14 = SparkFun-LED:WS2812B: WS2812B - Intelligent control LED integrated light source Technical Specifications: Power Supply Voltage (VDD): 3.5 to 5.3 V Input Voltage (VI): -0.5 to VDD+0.5 V Operating Junction Temperature (Topt): -25°C to +80°C Storage Temperature Range (Tstg): -55°C to +150°C; PROD_ID: DIO-12503
ENC_BL ENC_BR ENC_L ENC_R = jst-ph:B4B-PH-*: Wire-to-Board 2.0mm pitch top mount connector Source: http://www.jst-mfg.com/product/pdf/jpn/PH.pdf http://www.jst-mfg.com/product/detail.php?series=199
IR0 IR1-IR23 = TSSP58038:TSSP58038
LIGHT_GATE = jst-ph:B5B-PH-*: Wire-to-Board 2.0mm pitch top mount connector Source: http://www.jst-mfg.com/product/pdf/jpn/PH.pdf http://www.jst-mfg.com/product/detail.php?series=199
LOGIC_FUSE MOTOR_FUSE = fuse-holder-3568:3568-FUSEHOLDER
LOGIC_SWITCH M_BACK_LEFT M_BACK_RIGHT M_LEFT M_RIGHT MOTOR_SWITCH PWR_IN = jst-vh:B2P-VH: Wire-to-Board 3.96mm pitch top mount connector Source: http://www.jst-mfg.com/product/pdf/jpn/VH.pdf http://www.jst-mfg.com/product/detail.php?series=262
LS_CONNECTOR = pinhead+:PINHD-2X8: PIN HEADER
MASTER SLAVE_DEBUG SLAVE_MOTOR SLAVE_SENSOR = teensy-3.5:TEENSY-3.5
P1-P4 = VNH5050ATR-E:SOP50P1030X247-36N; A1_MAX: 0.32; A1_MIN: 0.23; A1_NOM: 0.275; A_MAX: 2.47; A_MIN: 2.15; A_NOM: 2.31; B_MAX: 0.36; B_MIN: 0.18; B_NOM: 0.27; D2_MAX: 0.0; D2_MIN: None; D2_NOM: None; D_MAX: 10.5; D_MIN: 10.1; D_NOM: 10.3; E1_MAX: 7.6; E1_MIN: 7.4; E1_NOM: 7.5; E2_MAX: 0.0; E2_MIN: None; E2_NOM: None; ENOM: 0.5; E_MAX: 10.5; E_MIN: 10.1; E_NOM: 10.3; L_MAX: 1.0; L_MIN: 0.6; L_NOM: 0.8; MANUFACTURER: STMicroelectronics; PIN_COUNT: 36.0; SNAPEDA_PACKAGE_ID: 23434
Q1 = SparkFun-DiscreteSemi:MOSFET-NCHANNEL: Common NMOSFET Parts MFG P/N Store ID Prod ID FDD8780 TRANS-09984 SI7820DN TRANS-11055 FDS6630A IC-08089 2N7002PW TRANS-11151 FQP30N06L COM-10213 TRANS-10060 BSS123LT1G TRANS-08345 BSS138 TRANS-00830 BS170 2N7000; PROD_ID: TRANS-00830
Q2 Q3 = SparkFun-DiscreteSemi:TRANSISTOR_NPN: Generic NPN BJT MMBT2222A - TRANS-08049 (SOT-23, 1A 40V) MPSA42 - TRANS-09116 (SOT-23, 500mA 300V) MMBT5088LT1G - TRANS-11160 (SOT-23, 50 mA 30V) BC547 - COM-08928 <http://www.sparkfun.com/products/8928> (TO-92 45V 100mA) (1.Collector 2.Base 3.Emitter) 2N3904 - COM-00521 <http://www.sparkfun.com/products/521> (TO-92 40V 200mA) (1.Emitter 2.Base 3.Collector) P2N2222A - COM-12852 <http://www.sparkfun.com/products/12852> (TO-92 40V 600mA) (1.Collector 2.Base 3.Emitter); PROD_ID: TRANS-08049
R1-R62 R67-R69 = SparkFun-Resistors:RESISTOR: Resistor Basic schematic elements and footprints for 0603, 1206, and PTH resistors.
SCREEN = Adafruit-2.4-TFT:ADAFRUIT-2.4-TFT
U$1 = openmv:OPENMV3
U$2 = Gyro:GYRO
VREG-3.3 = linear:LM340?-*: Positive VOLTAGE REGULATOR Source: http://cache.national.com/ds/LM/LM340.pdf
VREG-5 = V78-2000-switching-regulator:V78-2000